# EAGLE design TPaD Tablet v1 (EAGLE 6.4)
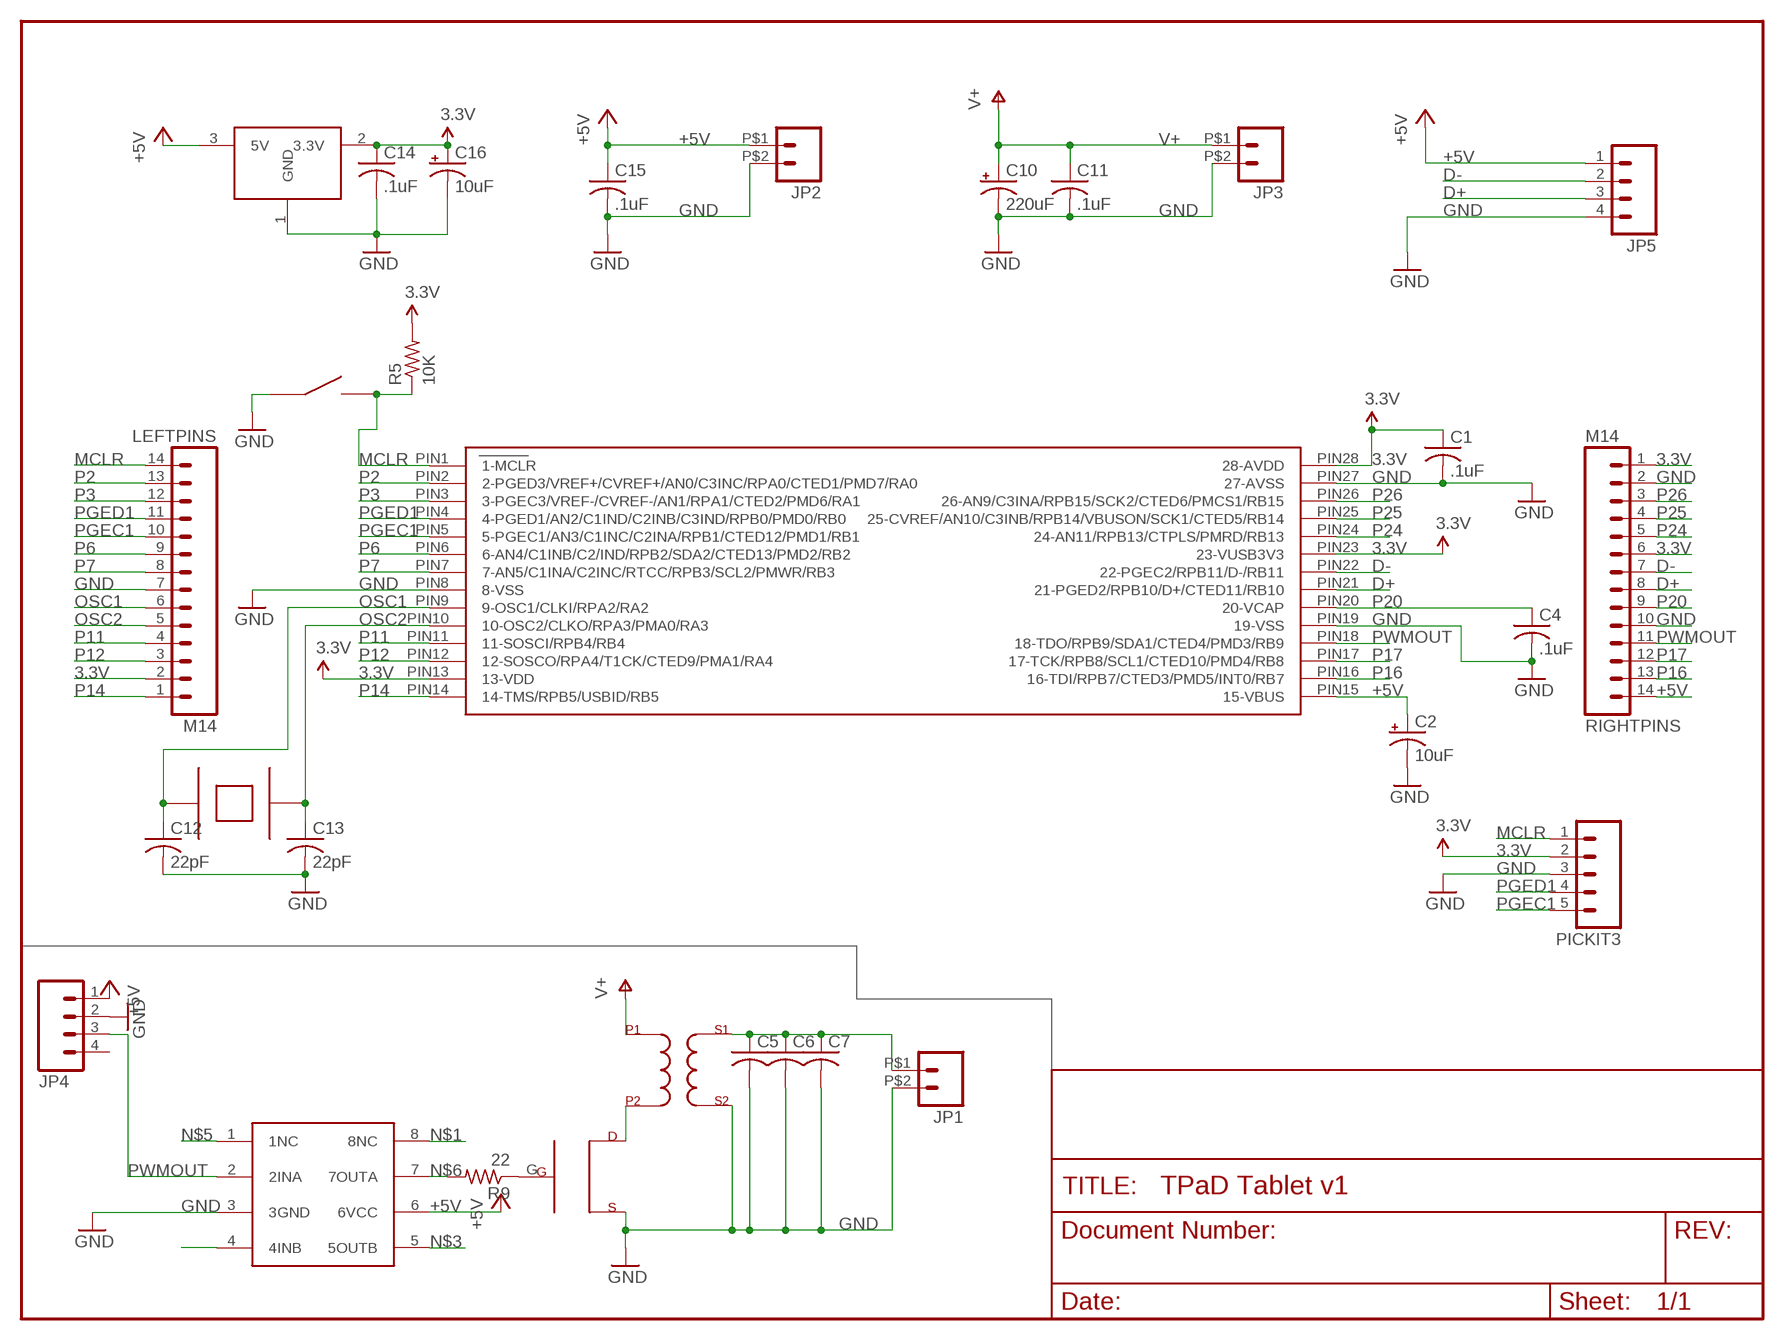
[diagram p0: schematic, sheet 1]

## Parts
C1  .1uF  C-US050-035X075  [C050-035X075]
C2  10uF  CPOL-USE2-5  [E2-5]
C4  .1uF  C-US050-035X075  [C050-035X075]
C5  C-US050-035X075  [C050-035X075]
C6  C-US050-035X075  [C050-035X075]
C7  C-US050-035X075  [C050-035X075]
C10  220uF  CPOL-USTT2D6  [TT2D6]
C11  .1uF  C-US050-035X075  [C050-035X075]
C12  22pF  C-US025-024X044  [C025-024X044]
C13  22pF  C-US025-024X044  [C025-024X044]
C14  .1uF  C-US050-035X075  [C050-035X075]
C15  .1uF  C-US050-035X075  [C050-035X075]
C16  10uF  CPOL-USE2-5  [E2-5]
JP1  M02PTH2  [1X02_BIG]
JP2  M02PTH2  [1X02_BIG]
JP3  M02PTH2  [1X02_BIG]
JP4  M04PTH  [1X04]
JP5  M04PTH  [1X04]
LEFTPINS  M14  [1X14]
PICKIT3  M05PTH  [1X05]
R5  10K  R-US_0207/10  [0207/10]
R9  22  R-US_0207/10  [0207/10]
RIGHTPINS  M14  [1X14]
U$1  PIC32MX250F128B  [DIP28-PIC32]
U$3  GATEDRIVER  [DIL-08]
U$4  TRANSFORMER  [TRANSFORMER]
U$5  TPAD_IRF520N  [TPAD_TO220]
U$6  LD33V  [SOT223]
U$7  OSCILLATOR  [OSC]
U$8  SWITCH  [OSC]

## Nets
3.3V: C1.1 C14.1 C16.+ LEFTPINS.2 PICKIT3.2 R5.2 RIGHTPINS.1 RIGHTPINS.6 U$1.PIN13(13-VDD) U$1.PIN23(23-VUSB3V3) U$1.PIN28(28-AVDD) U$6.2(3.3V)
+5V: C2.+ C15.1 JP2.P$1 JP4.1 JP5.1 RIGHTPINS.14 U$1.PIN15(15-VBUS) U$3.6(6VCC) U$6.3(5V)
D+: JP5.3 RIGHTPINS.8 U$1.PIN21(21-PGED2/RPB10/D+/CTED11/RB10)
D-: JP5.2 RIGHTPINS.7 U$1.PIN22(22-PGEC2/RPB11/D-/RB11)
GND: C1.2 C2.- C4.2 C5.2 C6.2 C7.2 C10.- C11.2 C12.2 C13.2 C14.2 C15.2 C16.- JP1.P$2 JP2.P$2 JP3.P$2 JP4.2 JP5.4 LEFTPINS.7 PICKIT3.3 RIGHTPINS.2 RIGHTPINS.10 U$1.PIN8(8-VSS) U$1.PIN19(19-VSS) U$1.PIN27(27-AVSS) U$3.3(3GND) U$4.S2 U$5.S U$6.1(GND) U$8.P$1
MCLR: LEFTPINS.14 PICKIT3.1 R5.1 U$1.PIN1(1-MCLR) U$8.P$3
N$1: U$3.8(8NC)
N$3: U$3.5(5OUTB)
N$4: U$3.4(4INB)
N$5: U$3.1(1NC)
N$6: R9.2 U$3.7(7OUTA)
N$13: R9.1 U$5.G
N$14: U$4.P2 U$5.D
N$17: C5.1 C6.1 C7.1 JP1.P$1 U$4.S1
OSC1: C12.1 LEFTPINS.6 U$1.PIN9(9-OSC1/CLKI/RPA2/RA2) U$7.P$3
OSC2: C13.1 LEFTPINS.5 U$1.PIN10(10-OSC2/CLKO/RPA3/PMA0/RA3) U$7.P$1
P2: LEFTPINS.13 U$1.PIN2(2-PGED3/VREF+/CVREF+/AN0/C3INC/RPA0/CTED1/PMD7/RA0)
P3: LEFTPINS.12 U$1.PIN3(3-PGEC3/VREF-/CVREF-/AN1/RPA1/CTED2/PMD6/RA1)
P6: LEFTPINS.9 U$1.PIN6(6-AN4/C1INB/C2/IND/RPB2/SDA2/CTED13/PMD2/RB2)
P7: LEFTPINS.8 U$1.PIN7(7-AN5/C1INA/C2INC/RTCC/RPB3/SCL2/PMWR/RB3)
P11: LEFTPINS.4 U$1.PIN11(11-SOSCI/RPB4/RB4)
P12: LEFTPINS.3 U$1.PIN12(12-SOSCO/RPA4/T1CK/CTED9/PMA1/RA4)
P14: LEFTPINS.1 U$1.PIN14(14-TMS/RPB5/USBID/RB5)
P16: RIGHTPINS.13 U$1.PIN16(16-TDI/RPB7/CTED3/PMD5/INT0/RB7)
P17: RIGHTPINS.12 U$1.PIN17(17-TCK/RPB8/SCL1/CTED10/PMD4/RB8)
P20: C4.1 RIGHTPINS.9 U$1.PIN20(20-VCAP)
P24: RIGHTPINS.5 U$1.PIN24(24-AN11/RPB13/CTPLS/PMRD/RB13)
P25: RIGHTPINS.4 U$1.PIN25(25-CVREF/AN10/C3INB/RPB14/VBUSON/SCK1/CTED5/RB14)
P26: RIGHTPINS.3 U$1.PIN26(26-AN9/C3INA/RPB15/SCK2/CTED6/PMCS1/RB15)
PGEC1: LEFTPINS.10 PICKIT3.5 U$1.PIN5(5-PGEC1/AN3/C1INC/C2INA/RPB1/CTED12/PMD1/RB1)
PGED1: LEFTPINS.11 PICKIT3.4 U$1.PIN4(4-PGED1/AN2/C1IND/C2INB/C3IND/RPB0/PMD0/RB0)
PWMOUT: JP4.3 RIGHTPINS.11 U$1.PIN18(18-TDO/RPB9/SDA1/CTED4/PMD3/RB9) U$3.2(2INA)
V+: C10.+ C11.1 JP3.P$1 U$4.P1
Unconnected: JP4.4

## Library data of the parts
C1 C4-C7 C11-C15 = rcl:C-US: CAPACITOR, American symbol
C2 C10 C16 = rcl:CPOL-US: POLARIZED CAPACITOR, American symbol
JP1-JP3 = SparkFun-Connectors:M02: Header 2 Standard 2-pin 0.1" header. Use with straight break away headers (SKU : PRT-00116), right angle break away headers (PRT-00553), swiss pins (PRT-00743), machine pins (PRT-00117), and female headers (PRT-00115). Molex polarized connector foot print use with SKU : PRT-08233 with associated crimp pins and housings.
JP4 = SparkFun:M04: Header 4 Standard 4-pin 0.1" header. Use with straight break away headers (SKU : PRT-00116), right angle break away headers (PRT-00553), swiss pins (PRT-00743), machine pins (PRT-00117), and female headers (PRT-00115). Molex polarized connector foot print use with SKU : PRT-08231 with associated crimp pins and housings. 1MM SMD Version SKU: PRT-10208
JP5 = SparkFun-Connectors:M04: Header 4 Standard 4-pin 0.1" header. Use with straight break away headers (SKU : PRT-00116), right angle break away headers (PRT-00553), swiss pins (PRT-00743), machine pins (PRT-00117), and female headers (PRT-00115). Molex polarized connector foot print use with SKU : PRT-08231 with associated crimp pins and housings. 1MM SMD Version SKU: PRT-10208
LEFTPINS RIGHTPINS = SparkFun:M14: Header 14 Standard 14-pin 0.1" header. Use with straight break away headers (SKU : PRT-00116), right angle break away headers (PRT-00553), swiss pins (PRT-00743), machine pins (PRT-00117), and female headers (PRT-00115).
PICKIT3 = SparkFun:M05: Header 5 Standard 5-pin 0.1" header. Use with straight break away headers (SKU : PRT-00116), right angle break away headers (PRT-00553), swiss pins (PRT-00743), machine pins (PRT-00117), and female headers (PRT-00115). Molex polarized connector foot print use with SKU : PRT-08230 with associated crimp pins and housings.
R5 R9 = rcl:R-US_: RESISTOR, American symbol
U$1 = TPaD:PIC32MX250F128B
U$3 = TPaD:GATEDRIVER
U$4 = TPaD:TRANSFORMER
U$5 = TPaD_Tablet_v1:TPAD_IRF520N
U$6 = TPaD:LD33V
U$7 = TPaD:OSCILLATOR
U$8 = TPaD:SWITCH

## Board
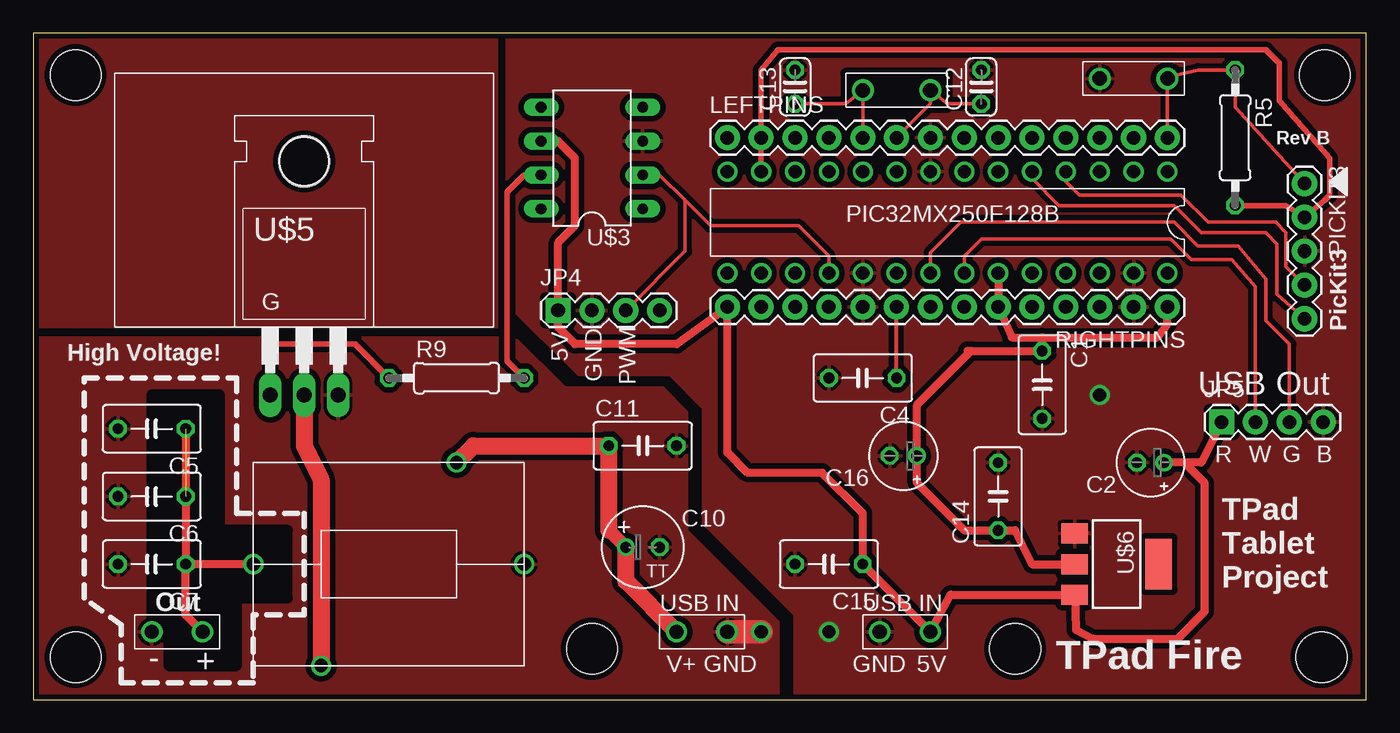
[diagram p1: board, top side]
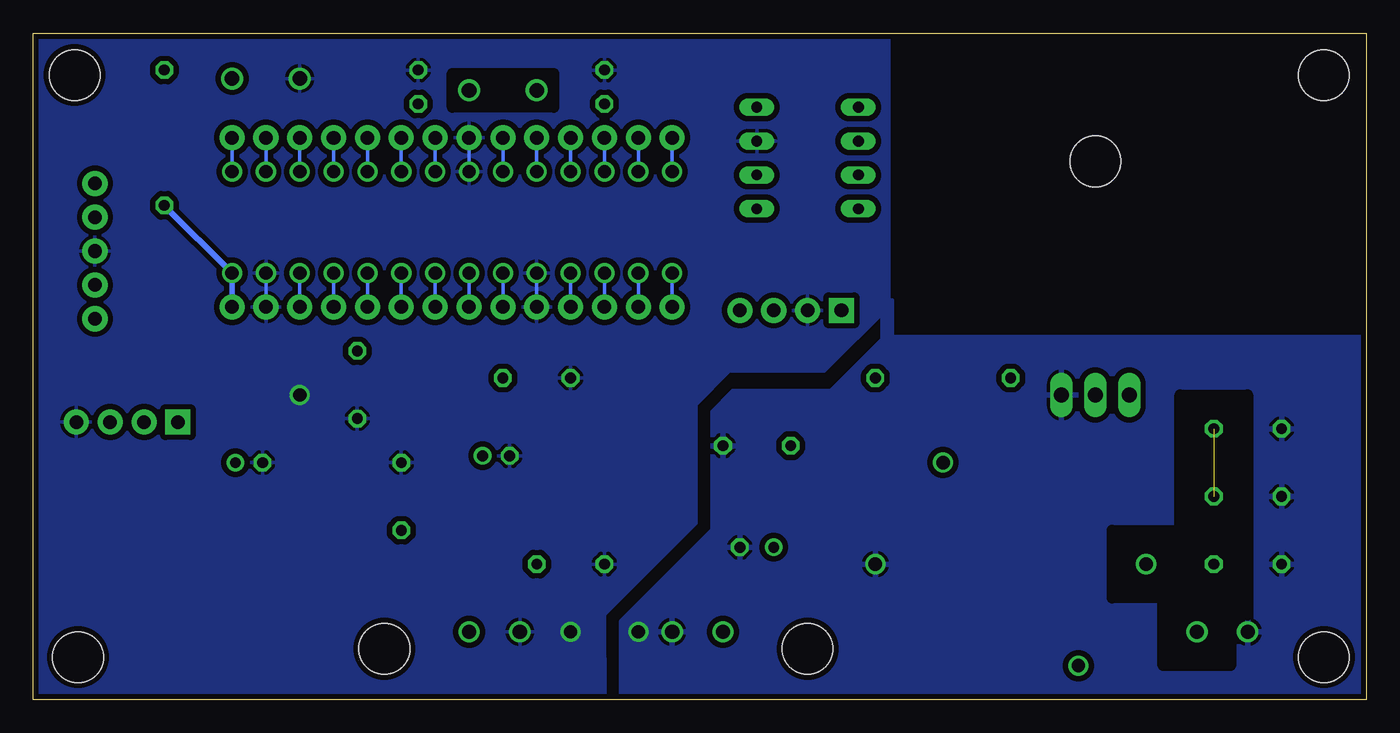
[diagram p2: board, bottom side, seen from below]

Size 100 x 50 mm. Coordinates in mm from the lower left corner, seen from the top.
Outline: 0,0 100,0 100,50 0,50 0,0
Copper layers (1*16): Top 0.035mm / dielectric 1.5mm / Bottom 0.035mm
Design rules "Fusion_eagle_rule_v1.1": minimum track width 6mil, minimum drill 12mil, track to track 6mil, track to pad 6mil, pad to pad 6mil, via to via 6mil, smd to smd 0mil, copper to edge 10mil, drill to drill 10mil, minimum pad ring 10mil, minimum via ring 6mil, stop-mask expansion 2mil, vias tented up to drill 100mil, thermal gap 10mil
Holes 3.81 mm at 96.65,3.17 96.9,46.86 3.17,46.86 3.17,3.17 41.91,3.81 73.66,3.81
tRestrict: area 8.9,6.4 to 14,22.9; area 10.2,2.5 to 15.2,7.6; area 12.7,7.6 to 19.1,12.7; area 61,44.5 to 68.6,47
bRestrict: area 8.9,6.4 to 14,22.9; area 10.2,2.5 to 15.2,7.6; area 61,44.5 to 68.6,47; area 12.7,7.6 to 19.1,12.7

### Footprints (pad centres in the part's own frame; a part is rotated, then mirrored left to right if it is on the bottom)
C050-035X075 = drill 0.813 octagon: 1 -2.54,0; 2 2.54,0
E2-5 = drill 0.813 pad 1.27: + -1.016,0 | drill 0.813 pad 1.27 octagon: - 1.016,0
TT2D6 = drill 0.813: + -1.27,0 | drill 0.813 octagon: - 1.27,0
C025-024X044 = drill 0.813 octagon: 1 -1.27,0; 2 1.27,0
1X02_BIG = drill 1.067: P$1 0,0; P$2 3.81,0
1X04 = drill 1.016 pad 1.88 square: 1 0,0 | drill 1.016 pad 1.88: 2 2.54,0; 3 5.08,0; 4 7.62,0
1X14 = drill 1.016 pad 1.88: 1 0,0; 2 2.54,0; 3 5.08,0; 4 7.62,0; 5 10.16,0; 6 12.7,0; 7 15.24,0; 8 17.78,0; 9 20.32,0; 10 22.86,0; 11 25.4,0; 12 27.94,0; 13 30.48,0; 14 33.02,0
1X05 = drill 1.016 pad 1.88: 1 0,0; 2 2.54,0; 3 5.08,0; 4 7.62,0; 5 10.16,0
0207/10 = drill 0.813 octagon: 1 -5.08,0; 2 5.08,0
DIP28-PIC32 = drill 1: PIN1 -3.81,16.51; PIN2 -3.81,13.97; PIN3 -3.81,11.43; PIN4 -3.81,8.89; PIN5 -3.81,6.35; PIN6 -3.81,3.81; PIN7 -3.81,1.27; PIN8 -3.81,-1.27; PIN9 -3.81,-3.81; PIN10 -3.81,-6.35; PIN11 -3.81,-8.89; PIN12 -3.81,-11.43; PIN13 -3.81,-13.97; PIN14 -3.81,-16.51; PIN15 3.81,-16.51; PIN16 3.81,-13.97; PIN17 3.81,-11.43; PIN18 3.81,-8.89; PIN19 3.81,-6.35; PIN20 3.81,-3.81; PIN21 3.81,-1.27; PIN22 3.81,1.27; PIN23 3.81,3.81; PIN24 3.81,6.35; PIN25 3.81,8.89; PIN26 3.81,11.43; PIN27 3.81,13.97; PIN28 3.81,16.51
DIL-08 = drill 0.813 long: 1 -3.81,-3.81; 2 -1.27,-3.81; 3 1.27,-3.81; 4 3.81,-3.81; 5 3.81,3.81; 6 1.27,3.81; 7 -1.27,3.81; 8 -3.81,3.81
TRANSFORMER = drill 1: P1 15.24,7.62; P2 5.08,-7.62; S1 0,0; S2 20.32,0
TPAD_TO220 = drill 1.118 long: D 0,-5.08; G -2.54,-5.08; S 2.54,-5.08 | hole 3.81: 0,12.446
SOT223 = smd 1.5 x 2: 1 -2.3,-3.15; 2 0,-3.15; 3 2.3,-3.15 | smd 3.8 x 2: 4 0,3.15
OSC = drill 1.1: P$1 -2.54,0; P$3 2.54,0

### Placement (x,y rotation side)
C1  75.69,23.62 270 top
C2  83.82,17.78 180 top
C4  62.23,24.13 180 top
C5  8.89,20.32 180 top
C6  8.89,15.24 180 top
C7  8.89,10.16 180 top
C10  45.72,11.43 0 top
C11  45.72,19.05 0 top
C12  71.12,45.97 90 top
C13  57.15,45.97 90 top
C14  72.39,15.24 90 top
C15  59.69,10.16 180 top
C16  65.28,18.29 180 top
JP1  12.7,5.08 180 top
JP2  67.31,5.08 180 top
JP3  48.26,5.08 0 top
JP4  39.37,29.21 0 top
JP5  89.15,20.83 0 top
LEFTPINS  52.07,42.16 0 top
PICKIT3  95.38,38.73 270 top
R5  90.17,42.16 270 top
R9  31.75,24.13 0 top
RIGHTPINS  85.09,29.46 180 top
U$1  68.58,35.81 270 top
U$3  41.91,40.64 90 top
U$4  16.51,10.16 0 top
U$5  20.32,27.94 0 top
U$6  81.28,10.16 270 top
U$7  64.77,45.72 0 top
U$8  82.55,46.61 0 top

### Tracks (layer width: path | path; a pad name or v marks a point on that pad's centre or on a via)
3.3V
  Top 0.406: R5.2 93.98,37.08 PICKIT3.2 96.9,37.47 97.28,37.85 97.28,40.64 93.47,44.96 93.47,47.75 92.46,48.77 55.88,48.77 54.61,47.24 LEFTPINS.2 U$1.PIN13
  Top 0.61: U$6.2 74.93,10.16 73.66,12.7 C14.1 69.85,12.7 66.29,16.26 C16.+ 66.29,22.1 70.36,26.16 | U$1.PIN23 RIGHTPINS.6 73.41,27.18 75.69,27.18 | 75.69,27.18 84.33,27.18 85.09,28.19 RIGHTPINS.1 | 70.1,26.16 70.36,26.16 | 70.36,26.16 C1.1 75.69,27.18
  Bottom 0.254: U$1.PIN23 RIGHTPINS.6 | LEFTPINS.2 U$1.PIN13
  Bottom 0.406: RIGHTPINS.1 U$1.PIN28 R5.2
+5V
  Top 0.61: JP5.1 87.63,17.78 C2.+ 86.36,17.78 87.88,16.26 87.88,6.6 85.85,4.57 79.5,4.57 78.23,5.22 U$6.3 68.82,7.86 JP2.P$1 C15.1 62.23,13.97 59.18,17.02 53.59,17.02 52.07,18.54 RIGHTPINS.14 48.26,26.67 40.64,26.67 39.37,27.94 JP4.1 39.37,34.29 40.64,35.56 40.64,40.64 39.37,41.91 U$3.6
  Bottom 0.254: RIGHTPINS.14 U$1.PIN15
D+
  Top 0.254: JP5.3 94.23,26.67 92.46,28.45 92.46,31.57 90.42,34.04 87.38,34.04 85.6,35.81 69.6,35.81 67.31,33.53 U$1.PIN21
  Bottom 0.254: U$1.PIN21 RIGHTPINS.8
D-
  Top 0.254: JP5.2 91.69,30.99 89.92,33.02 86.87,33.02 85.34,34.54 71.12,34.54 69.85,33.27 U$1.PIN22
  Bottom 0.254: U$1.PIN22 RIGHTPINS.7
GND  (via drill 1)
  Top 1.778: JP3.P$2 v54.61,5.08
  Bottom 0.254: U$1.PIN19 RIGHTPINS.10 | RIGHTPINS.2 U$1.PIN27 | LEFTPINS.7 U$1.PIN8
  other vias: 80.01,22.86 59.69,5.08
  pour Bottom (isolate 0.406): 57.11,0 57.15,6.35 50.29,13.21 50.29,22.1 47.75,24.64 40.64,24.64 35.81,29.46 35.81,50 100,50 100,0
  pour Top (isolate 0.406): 57.15,0 57.15,6.35 50.29,13.21 50.29,21.84 47.75,24.38 40.89,24.38 35.56,29.72 35.56,50 100,50 100,0
  pour Bottom (isolate 0.406): 55.88,0 55.88,5.84 49.02,12.7 49.02,21.59 47.5,23.11 40.13,23.11 36.07,27.18 0,27.18 0,0
  pour Top (isolate 0.406): 0,27.14 34.29,27.14 36.07,27.18 39.88,23.37 47.24,23.37 49.02,21.59 49.02,12.7 55.88,5.84 55.88,0.25 0,0
  pour Bottom: 35.56,25.65 35.56,29.97 36.32,29.97 36.32,25.65
MCLR
  Top 0.254: LEFTPINS.14 U$8.P$3 85.22,46.74 87.38,47.24 R5.1 90.17,44.45 PICKIT3.1
  Bottom 0.254: LEFTPINS.14 U$1.PIN1
N$2
  pour Top (isolate 0.406): 0,27.94 34.8,27.94 34.8,50.04 0,50.04
N$6
  Top 0.254: 36.83,39.37 U$3.7
  Top 0.406: R9.2 35.56,25.4 35.56,38.1 36.83,39.37
N$13
  Top 0.406: R9.1 24.13,26.67 17.78,26.67 U$5.G
N$14
  Top 1.27: U$5.D 20.32,19.05 21.59,16.51 U$4.P2
N$17  (1 unrouted)
  Top 0.61: U$4.S1 C7.1 | C5.1 C7.1 | JP1.P$1 11.43,6.35 C7.1
OSC1
  Top 0.254: C12.1 68.58,44.7 U$7.P$3 67.31,44.7 LEFTPINS.6
  Bottom 0.254: LEFTPINS.6 U$1.PIN9
OSC2
  Top 0.254: LEFTPINS.5 U$7.P$1 60.96,44.7 C13.1
  Bottom 0.254: LEFTPINS.5 U$1.PIN10
P2
  Bottom 0.254: LEFTPINS.13 U$1.PIN2
P3
  Bottom 0.254: LEFTPINS.12 U$1.PIN3
P6
  Bottom 0.254: LEFTPINS.9 U$1.PIN6
P7
  Bottom 0.254: LEFTPINS.8 U$1.PIN7
P11
  Bottom 0.254: LEFTPINS.4 U$1.PIN11
P12
  Bottom 0.254: LEFTPINS.3 U$1.PIN12
P14
  Bottom 0.254: LEFTPINS.1 U$1.PIN14
P16
  Bottom 0.254: U$1.PIN16 RIGHTPINS.13
P17
  Bottom 0.254: U$1.PIN17 RIGHTPINS.12
P20
  Top 0.305: C4.1 RIGHTPINS.9
  Bottom 0.254: U$1.PIN20 RIGHTPINS.9
P24
  Bottom 0.254: RIGHTPINS.5 U$1.PIN24
P25
  Bottom 0.254: RIGHTPINS.4 U$1.PIN25
P26
  Bottom 0.254: RIGHTPINS.3 U$1.PIN26
PGEC1
  Top 0.254: PICKIT3.5 93.29,30.43 93.29,34.19 92.46,35.05 87.63,35.05 85.6,37.08 76.96,37.08 74.93,39.12 U$1.PIN5
  Bottom 0.254: LEFTPINS.10 U$1.PIN5
PGED1
  Top 0.254: PICKIT3.4 93.98,32.51 93.98,35.05 93.22,35.81 88.14,35.81 86.11,37.85 78.49,37.85 77.47,38.86 U$1.PIN4
  Bottom 0.254: LEFTPINS.11 U$1.PIN4
PWMOUT
  Top 0.254: 48.9,37.47 50.8,35.56 57.4,35.56 59.69,33.27 U$1.PIN18 | 48.9,37.47 46.99,39.37 U$3.2 | JP4.3 48.9,33.66 48.9,37.47
  Bottom 0.254: U$1.PIN18 RIGHTPINS.11
V+
  Top 1.016: C10.+ 43.18,12.7
  Top 1.27: JP3.P$1 44.45,8.89 C10.+ | 43.18,12.7 C11.1 33.02,19.05 U$4.P1

### Text on the board
tPlace: Rev B | PicKit3 | High Voltage! | 5V | GND | PWM | USB Out | R | W | G | B | TPad | Tablet | Project | USB IN | USB IN | - | + | V+ | GND | GND | 5V | TPad Fire
_tsilk: Out